# EAGLE board cs8416 (EAGLE 4.15)
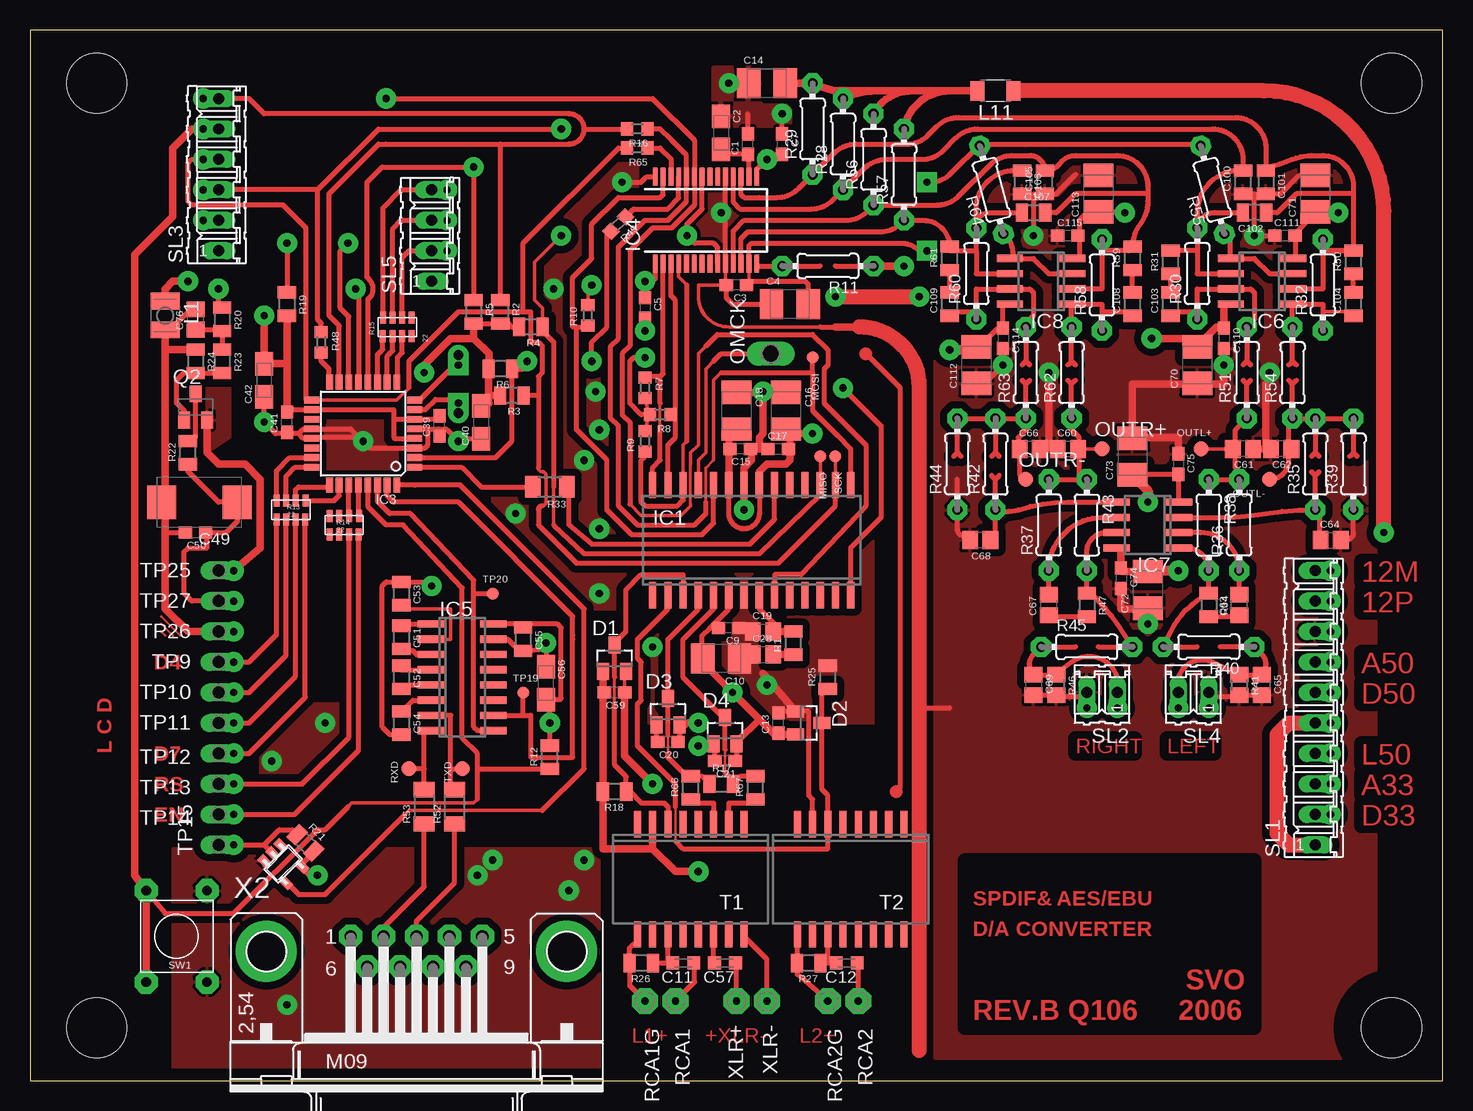
[diagram p2: board, top side]
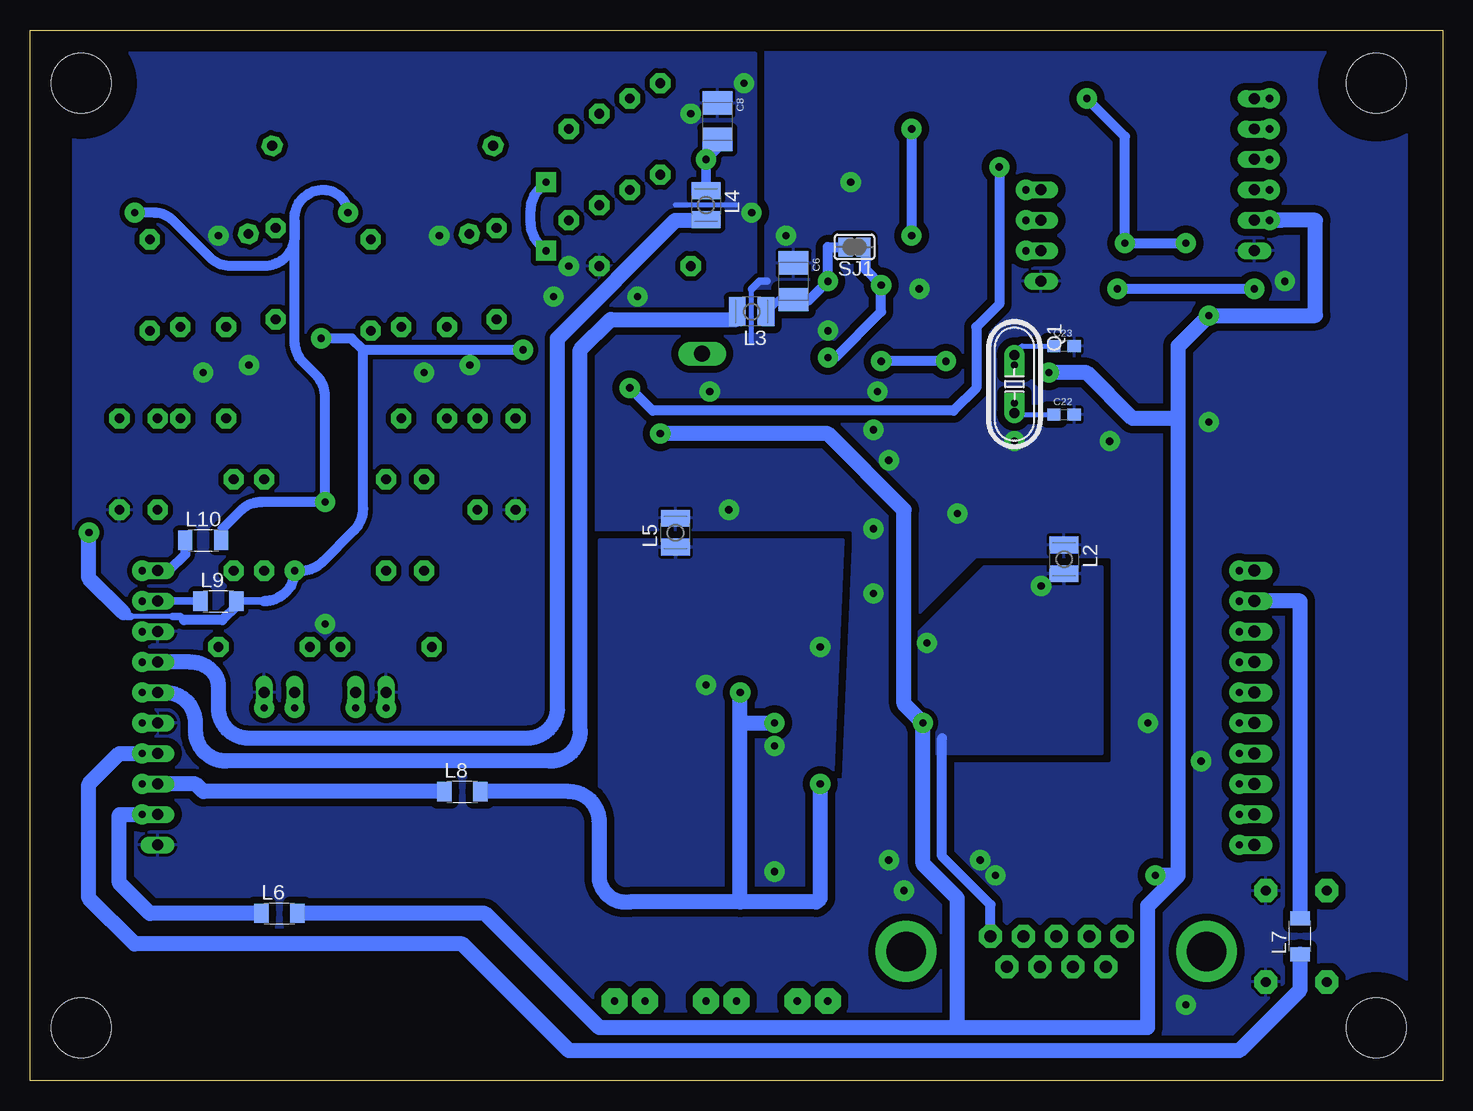
[diagram p3: board, bottom side, seen from below]

Size 117.78 x 87.62 mm. Coordinates in mm from the lower left corner, seen from the top.
Outline: 0,0 117.78,0 117.78,87.62 0,87.62 0,0
Copper layers (1*16): Top 0.035mm / dielectric 1.5mm / Bottom 0.035mm
Design rules "default": minimum track width 10mil, minimum drill 0.6mm, track to track 8mil, track to pad 8mil, pad to pad 8mil, via to via 8mil, smd to smd 0mil, copper to edge 40mil, drill to drill 8mil, minimum pad ring 10mil, minimum via ring 8mil, stop-mask expansion 4mil, vias tented up to drill 0mil, thermal gap 10mil
Net classes: 1 supply: width 0.406 mm, drill 0.5 mm, clearance 0.305 mm
Holes 5 mm at 5.55,83.18 5.55,4.44 113.5,4.44 113.5,83.18
tRestrict: area 109.5,0.4 to 117.5,8.5; area 109.5,79.2 to 117.5,87.2; area 1.5,79.2 to 9.6,87.2; area 1.7,0.6 to 9.4,8.2; area 80.5,4.4 to 99.5,18.4; area 77.9,4.4 to 80.5,18.4; area 99.5,4.4 to 102.1,18.4
bRestrict: area 1.5,79.2 to 9.6,87.2; area 1.7,0.6 to 9.4,8.3; area 109.5,0.4 to 117.5,8.5; area 109.5,79.2 to 117.5,87.2

## Footprints (pad centres in the part's own frame; a part is rotated, then mirrored left to right if it is on the bottom)
C0603 = smd 1.1 x 1: 1 -0.85,0; 2 0.85,0
A/3216-18R = smd 1.95 x 1.5: + 1.375,0; - -1.375,0
B/3528-21R = smd 1.95 x 2.5: + 1.525,0; - -1.525,0
C0603K = smd 1.05 x 1.08: 1 -0.875,0; 2 0.875,0
C0805 = smd 1.3 x 1.5: 1 -0.85,0; 2 0.85,0
SMC_E = smd 2.4 x 2.8: + -3.15,0; - 3.15,0
C0805S = smd 1.016 x 1.524: 1 -0.977,0; 2 0.977,0
SOT23 = smd 1 x 1.4: 1 -0.95,-1.1; 2 0.95,-1.1; 3 0,1.1
SO28W = smd 0.6 x 2.2: 1 -8.255,-4.6; 2 -6.985,-4.6; 3 -5.715,-4.6; 4 -4.445,-4.6; 5 -3.175,-4.6; 6 -1.905,-4.6; 7 -0.635,-4.6; 8 0.635,-4.6; 9 1.905,-4.6; 10 3.175,-4.6; 11 4.445,-4.6; 12 5.715,-4.6; 13 6.985,-4.6; 14 8.255,-4.6; 15 8.255,4.6; 16 6.985,4.6; 17 5.715,4.6; 18 4.445,4.6; 19 3.175,4.6; 20 1.905,4.6; 21 0.635,4.6; 22 -0.635,4.6; 23 -1.905,4.6; 24 -3.175,4.6; 25 -4.445,4.6; 26 -5.715,4.6; 27 -6.985,4.6; 28 -8.255,4.6
SOT23-5 = smd 0.69 x 0.99: 1 -0.95,-1.29; 2 0,-1.29; 3 0.95,-1.29; 4 0.95,1.3; 5 -0.95,1.3
TQFP32-08 = smd 1.27 x 0.559: 1 -4.293,2.8; 2 -4.293,2; 3 -4.293,1.2; 4 -4.293,0.4; 5 -4.293,-0.4; 6 -4.293,-1.2; 7 -4.293,-2; 8 -4.293,-2.8; 17 4.293,-2.8; 18 4.293,-2; 19 4.293,-1.2; 20 4.293,-0.4; 21 4.293,0.4; 22 4.293,1.2; 23 4.293,2; 24 4.293,2.8 | smd 0.559 x 1.27: 9 -2.8,-4.293; 10 -2,-4.293; 11 -1.2,-4.293; 12 -0.4,-4.293; 13 0.4,-4.293; 14 1.2,-4.293; 15 2,-4.293; 16 2.8,-4.293; 25 2.8,4.293; 26 2,4.293; 27 1.2,4.293; 28 0.4,4.293; 29 -0.4,4.293; 30 -1.2,4.293; 31 -2,4.293; 32 -2.8,4.293
SSOP28 = smd 0.4 x 1.5: 1 -4.225,-3.625; 2 -3.575,-3.625; 3 -2.925,-3.625; 4 -2.275,-3.625; 5 -1.625,-3.625; 6 -0.975,-3.625; 7 -0.325,-3.625; 8 0.325,-3.625; 9 0.975,-3.625; 10 1.625,-3.625; 11 2.275,-3.625; 12 2.925,-3.625; 13 3.575,-3.625; 14 4.225,-3.625; 15 4.225,3.625; 16 3.575,3.625; 17 2.925,3.625; 18 2.275,3.625; 19 1.625,3.625; 20 0.975,3.625; 21 0.325,3.625; 22 -0.325,3.625; 23 -0.975,3.625; 24 -1.625,3.625; 25 -2.275,3.625; 26 -2.925,3.625; 27 -3.575,3.625; 28 -4.225,3.625
SO16 = smd 0.6 x 2.2: 1 -4.445,-2.6; 2 -3.175,-2.6; 3 -1.905,-2.6; 4 -0.635,-2.6; 5 0.635,-2.6; 6 1.905,-2.6; 7 3.175,-2.6; 8 4.445,-2.6; 9 4.445,2.6; 10 3.175,2.6; 11 1.905,2.6; 12 0.635,2.6; 13 -0.635,2.6; 14 -1.905,2.6; 15 -3.175,2.6; 16 -4.445,2.6
SO08 = smd 0.6 x 2.2: 1 -1.905,-2.6; 2 -0.635,-2.6; 3 0.635,-2.6; 4 1.905,-2.6; 5 1.905,2.6; 6 0.635,2.6; 7 -0.635,2.6; 8 -1.905,2.6
L2825P = smd 1.4 x 2.4: 1 -1.2,0; 2 1.2,0
L3216C = smd 1.2 x 1.6: 1 -1.5,0; 2 1.5,0
TP10R = smd 1 x 1: TP 0,0
P1-13Y = drill 1.321 pad 1.905 long: 1 0,0
B1,27 = smd 1.27 x 1.27: PP 0,0
HC49/S = drill 0.813 pad 1.676 round: 1 -2.413,0; 2 2.413,0
SOT23-BEC = smd 1 x 1.4: B -0.95,-1.1; C 0,1.1; E 0.95,-1.1
R0805-SVO = smd 1.016 x 1.524: 1 -0.977,0; 2 0.977,0
R0603 = smd 1 x 1.1: 1 -0.85,0; 2 0.85,0
0204/7 = drill 0.813 pad 1.676 octagon: 1 -3.81,0; 2 3.81,0
RESSMD-YC16 = smd 0.5 x 1: R1$1 -1.23,-0.77; R1$2 -1.2,0.8; R2$1 -0.4,-0.77; R2$2 -0.4,0.8; R3$1 0.4,-0.77; R3$2 0.4,0.8; R4$1 1.2,-0.77; R4$2 1.2,0.8
R1206-GAP = smd 1.27 x 1.778: 1 -1.422,0; 2 1.422,0
R0805 = smd 1.3 x 1.5: 1 -0.85,0; 2 0.85,0
P1-13 = drill 0.61 pad 2.159 octagon: 1 0,0
SJ = smd 1.168 x 1.6: 1 -0.762,0; 2 0.762,0
10P = drill 0.914 long: 1 -11.43,0; 2 -8.89,0; 3 -6.35,0; 4 -3.81,0; 5 -1.27,0; 6 1.27,0; 7 3.81,0; 8 6.35,0; 9 8.89,0; 10 11.43,0
02P = drill 0.914 long: 1 -1.27,0; 2 1.27,0
06P = drill 0.914 long: 1 -6.35,0; 2 -3.81,0; 3 -1.27,0; 4 1.27,0; 5 3.81,0; 6 6.35,0
04P = drill 0.914 long: 1 -3.81,0; 2 -1.27,0; 3 1.27,0; 4 3.81,0
6X6_BUTTON_THRU = drill 0.813 pad 1.93 octagon: 1 -2.54,3.81; 2 -2.54,-3.81; 3 2.54,-3.81; 4 2.54,3.81
SO16WW = smd 0.6 x 2.2: 1 -4.445,-4.6; 2 -3.175,-4.6; 3 -1.905,-4.6; 4 -0.635,-4.6; 5 0.635,-4.6; 6 1.905,-4.6; 7 3.175,-4.6; 8 4.445,-4.6; 9 4.445,4.6; 10 3.175,4.6; 11 1.905,4.6; 12 0.635,4.6; 13 -0.635,4.6; 14 -1.905,4.6; 15 -3.175,4.6; 16 -4.445,4.6
P1-13Y-SVO = drill 1 long: 1 0,0
M09HP = drill 1.016 pad 1.93 octagon: 1 -5.486,1.27; 2 -2.743,1.27; 3 0,1.27; 4 2.743,1.27; 5 5.486,1.27; 6 -4.115,-1.27; 7 -1.372,-1.27; 8 1.372,-1.27; 9 4.115,-1.27 | drill 3.302 pad 5.08 round: G1 -12.522,0; G2 12.522,0

## Placement (x,y rotation side)
C1  100nF  [C0603]  59.84,78.1 90 top
C2  10uF  [A/3216-18R]  57.62,79.05 270 top
C3  100nF  [C0603]  58.89,66.35 180 top
C4  47uF  [B/3528-21R]  63.34,64.77 0 top
C5  100nF  [C0603]  51.27,64.45 270 top
C6  47uF  [B/3528-21R]  54.13,66.67 270 bottom
C7  100nF  [C0603]  62.7,78.1 270 top
C8  47uF  [B/3528-21R]  60.48,80 270 bottom
C9  100nF  [C0603]  58.26,37.78 180 top
C10  47uF  [B/3528-21R]  57.62,35.24 180 top
C11  100nF  [C0603K]  54.45,9.84 180 top
C12  100nF  [C0603K]  68.1,9.84 180 top
C13  100nF  [C0603]  62.38,29.84 90 top
C14  4.7uF  [B/3528-21R]  61.43,83.18 0 top
C15  100nF  [C0603]  59.21,52.7 180 top
C16  47uF  [B/3528-21R]  63.02,55.88 270 top
C17  100nF  [C0603]  62.38,52.7 0 top
C18  47uF  [B/3528-21R]  58.89,55.88 270 top
C19  10NF:C0G  [C0805]  61.11,37.46 0 top
C20  100nF  [C0603]  53.17,28.25 180 top
C21  100nF  [C0603]  57.94,26.66 180 top
C22  22pF  [C0603]  31.59,55.56 0 bottom
C23  22pF  [C0603]  31.59,61.27 0 bottom
C28  220nF:X7R  [C0805]  61.11,35.55 0 top
C39  100nF  [C0603]  34.12,54.61 90 top
C40  4.7uF  [A/3216-18R]  37.62,54.92 90 top
C41  100nF  [C0603]  21.42,54.92 90 top
C42  4.7uF  [A/3216-18R]  19.52,58.41 90 top
C49  220uF  [SMC_E]  14.12,48.26 180 top
C50  100nF  [C0603]  13.8,45.72 180 top
C51  100nF  [C0805S]  30.95,36.98 270 top
C52  100nF  [C0805S]  30.95,33.65 270 top
C53  100nF  [C0805S]  30.95,40.64 270 top
C54  100nF  [C0805S]  30.95,29.84 270 top
C55  100nF  [C0805S]  41.11,36.83 270 top
C56  4.7uF  [A/3216-18R]  43.01,33.17 270 top
C57  100nF  [C0603K]  57.94,9.84 180 top
C59  100nF  [C0603]  48.73,32.38 180 top
C60  5.6nF NP0  [C0805]  86.51,52.7 0 top
C61  5.6nF NP0  [C0805]  101.12,52.7 180 top
C62  5.6nF NP0  [C0805]  104.29,52.7 180 top
C63  2.7nF NP0  [C0805]  100.8,39.68 90 top
C64  2.7nF NP0  [C0805]  108.42,45.08 0 top
C65  3.9nF  [C0805]  102.7,33.02 270 top
C66  5.6nF NP0  [C0805]  83.34,52.7 0 top
C67  2.7nF NP0  [C0805]  84.92,39.68 90 top
C68  2.7nF NP0  [C0805]  79.21,45.08 180 top
C69  3.9nF  [C0805]  83.66,33.02 270 top
C70  4.7uF  [B/3528-21R]  97.31,59.69 90 top
C71  4.7uF  [B/3528-21R]  107.15,73.97 90 top
C72  4.7uF  [B/3528-21R]  93.18,40.95 90 top
C73  4.7uF  [B/3528-21R]  91.91,52.07 90 top
C74  100nF  [C0603]  90.96,41.91 270 top
C75  100nF  [C0603]  95.72,51.43 270 top
C76  100nF  [C0805]  13.8,63.5 90 top
C100  NC  [C0805S]  101.12,74.92 90 top
C101  NC  [C0805S]  103.02,74.92 270 top
C102  100pF  [C0805S]  102.07,72.39 180 top
C103  100pF  [C0805S]  95.08,64.77 90 top
C104  100pF  [C0805S]  110.33,64.77 90 top
C105  NC  [C0805S]  84.61,74.92 90 top
C106  NC  [C0805S]  82.7,74.92 270 top
C107  100pF  [C0805S]  83.66,72.39 0 top
C108  100pF  [C0805S]  91.91,64.77 90 top
C109  100pF  [C0805S]  76.67,64.77 90 top
C110  100nF  [C0603]  99.53,61.91 270 top
C111  100nF  [C0603]  104.61,70.48 0 top
C112  4.7uF  [B/3528-21R]  78.89,59.69 90 top
C113  4.7uF  [B/3528-21R]  89.05,73.97 90 top
C114  100nF  [C0603]  81.11,61.91 270 top
C115  100nF  [C0603]  86.51,70.48 0 top
D1  BAT54S  [SOT23]  48.73,35.24 0 top
D2  BAT54S  [SOT23]  64.92,29.84 270 top
D3  BAT54S  [SOT23]  53.17,30.79 0 top
D4  BAT54S  [SOT23]  57.94,29.2 0 top
IC1  CS8416-CSZ  [SO28W]  60.16,45.08 0 top
IC2  74AHC1G14DBV  [SOT23-5]  21.11,18.09 225 top
IC3  MEGA8-AI  [TQFP32-08]  27.77,53.97 180 top
IC4  AD1955  [SSOP28]  56.35,71.75 0 top
IC5  ADM3202ARN  [SO16]  36.03,33.65 270 top
IC6  OP275S  [SO08]  102.7,66.67 90 top
IC7  OP275S  [SO08]  93.18,46.35 90 top
IC8  OP275S  [SO08]  84.29,66.67 90 top
L1  [L2825P]  11.26,63.81 270 top
L2  [L2825P]  31.59,43.49 270 bottom
L3  [L2825P]  57.62,64.13 180 bottom
L4  [L2825P]  61.43,73.02 270 bottom
L5  [L2825P]  63.97,45.72 90 bottom
L6  [L3216C]  96.99,13.96 0 bottom
L7  [L3216C]  11.9,12.06 90 bottom
L8  [L3216C]  81.75,24.12 0 bottom
L9  [L3216C]  102.07,40 0 bottom
L10  [L3216C]  103.34,45.08 0 bottom
L11  [L3216C]  80.48,82.55 180 top
MISO  TPTP10R  [TP10R]  65.88,52.07 270 top
MOSI  TPTP10R  [TP10R]  65.24,60.32 270 top
OMCK  TPSPAD1-13Y  [P1-13Y]  61.75,60.64 90 top
OUTL+  TPB1,27  [B1,27]  97.62,52.7 90 top
OUTL-  TPB1,27  [B1,27]  103.34,50.16 270 top
OUTR+  TPB1,27  [B1,27]  89.37,52.7 0 top
OUTR-  TPB1,27  [B1,27]  83.02,50.16 0 top
Q1  [HC49/S]  35.71,58.1 270 bottom
Q2  BC817-40SMD  [SOT23-BEC]  13.8,56.19 0 top
R1  1K  [R0805-SVO]  63.65,36.51 90 top
R2  4.7K  [R0805-SVO]  39.2,64.13 270 top
R3  4.7K  [R0805-SVO]  40.16,57.15 180 top
R4  4.7K  [R0805-SVO]  41.74,62.86 180 top
R5  4.7K  [R0805-SVO]  36.98,64.13 270 top
R6  4.7K  [R0805-SVO]  39.2,59.37 180 top
R7  4.7K  [R0603]  51.27,57.78 270 top
R8  4.7K  [R0603]  52.54,55.56 180 top
R9  4.7K  [R0603]  51.27,53.34 90 top
R10  4.7K  [R0603]  46.51,63.81 90 top
R11  2.49K  [0204/7]  66.51,67.94 180 top
R12  10K  [R0805-SVO]  43.33,26.98 90 top
R13  22  [RESSMD-YC16]  21.74,47.62 180 top
R14  22  [RESSMD-YC16]  26.19,46.35 180 top
R15  22  [RESSMD-YC16]  30.63,62.86 0 top
R16  22  [R0603]  50.63,79.37 180 top
R17  90.9  [R0805-SVO]  57.62,24.76 0 top
R18  75  [R0805-SVO]  48.73,24.12 180 top
R19  10K  [R0805-SVO]  21.42,64.77 270 top
R20  1K  [R0805-SVO]  16.03,63.5 270 top
R21  10K  [R0805-SVO]  22.96,19.86 315 top
R22  47  [R0805-SVO]  13.17,52.38 90 top
R23  1K  [R0805-SVO]  16.03,60 270 top
R24  10K  [R0805-SVO]  13.8,60 270 top
R25  75  [R0805-SVO]  66.51,33.65 90 top
R26  NC  [R0805-SVO]  50.95,9.84 180 top
R27  NC  [R0805-SVO]  64.92,9.84 180 top
R28  2.00K  [0204/7]  67.78,78.1 90 top
R29  2.00K  [0204/7]  65.24,79.37 90 top
R30  2.00K  [0204/7]  97.31,67.31 90 top
R31  100  [R0805-SVO]  95.08,68.26 90 top
R32  2.00K  [0204/7]  107.78,66.35 90 top
R33  000  [R1206-GAP]  43.33,49.52 180 top
R34  100  [R0805-SVO]  98.26,39.68 270 top
R35  324  [0204/7]  107.15,51.43 90 top
R36  324  [0204/7]  100.8,46.35 90 top
R37  324  [0204/7]  84.92,46.35 90 top
R38  226  [0204/7]  98.26,46.35 270 top
R39  226  [0204/7]  110.33,51.43 90 top
R40  332  [0204/7]  98.26,36.19 180 top
R41  OPEN  [R0805]  100.8,33.02 270 top
R42  324  [0204/7]  80.48,51.43 90 top
R43  226  [0204/7]  88.1,46.35 270 top
R44  226  [0204/7]  77.3,51.43 90 top
R45  332  [0204/7]  88.1,36.19 0 top
R46  OPEN  [R0805]  85.56,33.02 270 top
R47  100  [R0805-SVO]  88.1,39.68 270 top
R48  22  [R0603]  24.28,61.59 270 top
R49  22  [R0603]  49.05,71.43 225 top
R50  100  [R0805-SVO]  110.33,68.26 90 top
R51  681  [0204/7]  101.44,59.05 90 top
R52  000  [R1206-GAP]  35.39,22.85 90 top
R53  000  [R1206-GAP]  32.86,22.85 90 top
R54  681  [0204/7]  105.25,59.05 90 top
R55  402  [0204/7]  98.58,74.29 105 top
R56  2.00K  [0204/7]  70.32,76.83 90 top
R57  2.00K  [0204/7]  72.86,75.56 90 top
R58  2.00K  [0204/7]  89.37,66.35 90 top
R59  100  [R0805-SVO]  91.91,68.58 90 top
R60  2.00K  [0204/7]  78.89,67.31 90 top
R61  100  [R0805-SVO]  76.67,68.58 90 top
R62  681  [0204/7]  86.83,59.05 90 top
R63  681  [0204/7]  83.02,59.05 90 top
R64  402  [0204/7]  80.16,74.29 105 top
R65  22  [R0603]  50.63,77.78 180 top
R66  10  [R0805-SVO]  55.08,24.44 90 top
R67  10  [R0805-SVO]  60.48,24.44 90 top
RCA1  TPSPAD1-13  [P1-13]  53.81,6.66 0 top
RCA1G  TPSPAD1-13  [P1-13]  51.27,6.66 0 top
RCA2  TPSPAD1-13  [P1-13]  69.05,6.66 0 top
RCA2G  TPSPAD1-13  [P1-13]  66.51,6.66 0 top
RXD  TPB1,27  [B1,27]  31.59,26.03 0 top
SCK  TPTP10R  [TP10R]  67.14,52.07 270 top
SJ1  [SJ]  49.05,69.53 180 bottom
SL1  [10P]  107.15,31.11 90 top
SL2  [02P]  89.37,32.38 180 top
SL3  [06P]  15.71,75.56 90 top
SL4  [02P]  96.99,32.38 180 top
SL5  [04P]  33.49,70.48 90 top
SW1  BUTTON_6X6_THRU  [6X6_BUTTON_THRU]  12.22,12.06 0 top
T1  TG26-1205N1  [SO16WW]  55.08,16.82 180 top
T2  TG26-1205N1  [SO16WW]  68.41,16.82 180 top
TP9  TPPAD1-10Y  [P1-13Y-SVO]  15.71,34.92 90 top
TP10  TPPAD1-10Y  [P1-13Y-SVO]  15.71,32.38 90 top
TP11  TPPAD1-10Y  [P1-13Y-SVO]  15.71,29.84 90 top
TP12  TPPAD1-10Y  [P1-13Y-SVO]  15.71,27.3 90 top
TP13  TPPAD1-10Y  [P1-13Y-SVO]  15.71,24.76 90 top
TP14  TPPAD1-10Y  [P1-13Y-SVO]  15.71,22.22 270 top
TP15  TPPAD1-10Y  [P1-13Y-SVO]  15.71,19.68 90 top
TP19  TPTP10R  [TP10R]  41.11,32.38 0 top
TP20  TPTP10R  [TP10R]  38.57,40.64 0 top
TP25  TPPAD1-10Y  [P1-13Y-SVO]  15.71,42.54 90 top
TP26  TPPAD1-10Y  [P1-13Y-SVO]  15.71,37.46 90 top
TP27  TPPAD1-10Y  [P1-13Y-SVO]  15.71,40 90 top
TXD  TPB1,27  [B1,27]  36.03,26.03 0 top
X2  [M09HP]  32.22,10.79 0 top
XLR+  TPSPAD1-13  [P1-13]  58.89,6.66 0 top
XLR-  TPSPAD1-13  [P1-13]  61.43,6.66 0 top

## Tracks (layer width: path | path; a pad name or v marks a point on that pad's centre or on a via)
+5VLCD
  Top 0.406: TP27.1 13.49,40 12.85,40.64 12.85,44.13 13.17,44.45 14.76,44.45 14.76,45.72 C50.1 16.34,45.72 17.3,46.67 17.3,48.26 C49.+ 15.71,48.26 13.17,50.8 R22.1
  Bottom 1.27: TP27.1 11.9,40 L7.2
+12V  (via drill 0.6 pad 1.68)
  Top 0.305: 97.31,61.91 C70.+
  Top 0.406: 100.17,64.77 IC6.8 99.53,64.77 | IC8.8 81.11,64.77 C114.1 80.69,62.76 79.15,61.21 C112.+
  Top 0.61: IC7.8 90.96,44.45 C74.1 90.96,42.54 91.02,42.48 C72.+ | v93.5,61.91 97.31,61.91 97.94,61.91 98.89,62.86 99.21,62.86 99.31,62.76 C110.1 99.53,64.77
  Top 0.813: C72.+ 93.18,42.54 v95.72,42.54 | C112.+ 78.83,61.21 78.58,60.95 v76.67,60.95
  Top 1.27: L11.1 102.86,82.55 arc-90 112.86,72.55 v112.86,45.72
  Bottom 0.406: 105.88,38.73 109.37,38.73
  Bottom 0.61: 98.26,40 L9.2 100.57,39.59 | 104.93,38.41 105.25,38.73 105.88,38.73 | 109.37,38.73 109.69,38.73 110.01,39.05
  Bottom 0.813: 98.26,40 arc-90 v95.72,42.54 95.19,42.54 arc-45 93.39,43.28 90.75,45.92 arc-45 90,47.72 90,60.95 | 100.57,39.59 101.75,38.41 104.93,38.41 | 90,60.95 v76.67,60.95 | v93.5,61.91 90.96,61.91 90,60.95
  Bottom 1.27: 110.01,39.05 112.86,41.91 v112.86,45.72
-12V  (via drill 0.6 pad 1.68)
  Top 0.406: IC6.4 105.56,68.58 105.46,68.68 C111.2 105.46,70.7 107.15,72.39 C71.- | IC7.4 95.72,48.26 C75.2 92.01,50.58 arc90 91.91,50.48 | 87.47,71.75 88.16,72.45 C113.- 91.21,72.45 v91.28,72.39 | C115.2 87.47,70.48 87.47,71.75 | 87.47,71.75 87.47,68.58 IC8.4 86.83,68.58
  Top 0.813: C73.- 91.91,50.48 93.18,49.21 v93.18,48.26 | C71.- 108.99,72.45 v109.05,72.39
  Bottom 0.813: 95.72,71.75 95.72,61.69 arc-45 94.98,59.89 93.92,58.84 arc45 93.18,57.05 v93.18,48.26 98.48,48.26 arc-45 100.27,47.51 101.75,46.03 101.75,45.08 L10.2 | 95.72,71.75 95.72,70.48 arc90 98.26,67.94 101.02,67.94 arc45 102.81,68.68 105.88,71.75 arc-45 107.41,72.39 v109.05,72.39 | 95.72,71.75 arc90 93.5,74.29 arc90 v91.28,72.39
AGND  (via drill 0.6 pad 1.68)
  Top 0.305: 57.98,72.03 v57.62,72.39 57.98,72.74 | IC4.10 57.98,66.07 57.94,66.03 C3.2 55.71,66.35 55.71,65.4 arc90 58.26,62.86 65.88,62.86 | 101.12,73.97 C100.1 | v102.07,70.48 C111.1 | 102.07,73.95 102.07,73.97 | C101.2 103.02,73.97 | C70.- 98,58.8 | C106.2 82.7,73.97 82.73,73.95 83.66,73.95 | 83.66,73.95 C105.1 | 83.66,73.95 83.66,73.97
  Top 0.406: IC4.10 57.98,72.03 | C7.1 v62.7,80.64 | C1.2 59.84,80.64 | C111.1 v102.07,70.48 102.07,73.95 | v99.53,59.69 C110.2 | 102.07,73.95 101.14,73.95 101.12,73.97 | 102.07,73.95 C101.2 | C71.+ 105.82,75.5 104.29,73.97 103.02,73.97 | 83.66,73.95 v83.66,70.48 | C105.1 85.53,73.95 87.15,75.56 | 79.53,58.1 v81.11,59.69 | C66.2 84.92,52.7 C60.1 | 103.02,52.7 C62.2 | C68.2 78.26,45.08 77.94,45.4 arc-90 77.3,46.03 R44.1 77.3,50.16 | C64.2 109.69,45.08 arc90 110.33,45.72 R39.1 | C69.2 85.46,32.16 85.56,32.06 | 100.8,32.06 R41.2 | C65.2 100.9,32.16 100.8,32.06 | 85.56,32.06 R46.2 | 85.56,32.06 87.78,32.06 SL2.2 | 100.8,32.06 98.58,32.06 SL4.1 | 74.13,31.11 76.67,31.11 | 65.88,62.86 67.14,62.86 | 67.14,67.94 R11.1 | 57.98,72.74 IC4.19 | C2.- 57.62,80.64 | C14.- v58.26,83.18 | C3.2 58.04,65.3 58.57,64.77 C4.-
  Top 0.61: R11.1 v72.86,67.94 | C61.1 103.02,52.7 103.02,58.1 | 96.67,58.1 C70.- | 96.67,58.1 99.53,58.1 v99.53,59.69 | 96.67,58.1 91.91,58.1 91.91,53.65 | 84.92,52.7 84.92,58.1 | C75.1 95.72,53.65 91.91,53.65 | C73.+ 91.91,53.65 | C74.2 90.96,39.37 92.86,39.37 92.92,39.43 C72.- v93.18,38.09 | 67.14,62.86 69.05,62.86
  Top 1.27: 74.13,2.54 74.13,31.11 74.13,57.86 arc90 69.13,62.86 | v67.14,65.4 v74.13,65.4
  Bottom 0.406: 58.89,73.02 63.97,73.02
  other vias: 84.92,59.05 103.34,59.05
  pour Bottom (isolate 0.406, rank 2): 57.3,85.72 57.3,63.5 72.86,63.5 72.86,27.3 114.14,27.3 114.14,85.72
  pour Top (isolate 0.61, rank 2): 75.4,83.18 75.4,1.9 112.23,1.9 112.23,83.18
  pour Top (isolate 0.305, rank 2): 55.08,73.97 59.52,73.97 59.52,69.53 55.08,69.53
  pour Top (isolate 0.305, rank 2): 56.98,84.45 56.98,79.69 63.34,79.69 63.34,80.96 63.02,81.28 61.11,81.28 60.8,81.59 60.8,84.45
AVDD  (via drill 0.6 pad 1.68)
  Top 0.305: 60.58,75.98 IC4.15
  Top 0.406: 60.58,75.98 v61.43,76.83 61.85,77.25 C7.2
  Bottom 0.305: 60.48,77.78 C8.+
  Bottom 0.8: L4.1 v61.43,76.83 60.48,77.78
AVDDDAC
  Bottom 1.27: L4.2 61.43,71.75 63.97,71.75 73.81,61.91 73.81,31.11 arc90 76.35,28.57 99.53,28.57 arc90 102.07,31.11 102.07,32.91 arc-45 102.6,34.18 arc-45 104.39,34.92 SL1.7
B1IN  (via drill 0.6 pad 1.68)
  Top 0.406: IC2.2 | TP15.1 v16.98,19.68 19.52,19.68 | 19.52,19.68 IC2.2 | R21.1 21.87,20.95 20.79,20.95 19.52,19.68
BATON1
  Top 0.305: 42.7,22.54 31.59,22.54 31.27,22.22
  Top 0.406: IC3.32 32.07,49.68 32.06,49.68 | 21.43,16.5 IC2.4 21.42,16.5 21.42,16.51 22.38,15.55 24.6,15.55 31.27,22.22 | 42.7,22.54 46.19,26.03 46.19,39.37 35.87,49.68 32.06,49.68 | 32.06,49.68
BCLK
  Top 0.305: 53.81,55.56 R8.1
  Top 0.406: IC1.27 53.17,53.02 53.81,53.65 53.81,55.56 53.81,65.08 53.42,65.47 IC4.3
COM_GND  (via drill 0.6 pad 1.68)
  Top 0.305: 43.02,34.92 | C56.- 43.02,34.92 | 43.02,34.92 42.66,35.27 | v43.02,36.51
  Top 0.406: C56.- v43.02,36.51 42.48,35.98 C55.2 40.69,35.98 39.84,36.83 IC5.15 | C54.2 30.95,28.89 30,28.89 29.36,29.52 29.36,41.27 29.7,41.61 C53.1 33.15,41.61 v33.49,41.27
  Bottom 0.813: X2.5 37.71,14.69 41.74,18.73 41.74,28.57
  pour Bottom (isolate 0.406): 28.41,27.3 28.41,42.86 38.25,42.86 43.65,37.46 43.65,27.3
COM_RXD
  Top 0.406: R53.2 32.86,26.03 | 32.86,26.03 RXD.PP | 32.86,26.03 32.86,29.2 IC5.8 33.49,29.2
COM_TXD
  Top 0.406: IC5.7 35.08,30.48 35.08,26.03 | R52.2 35.24,24.28 35.08,24.44 35.08,26.03 | 35.08,26.03 TXD.PP
DVDD  (via drill 0.6 pad 1.68)
  Top 0.406: IC4.1 52.12,66.89 v51.27,66.67 C5.1
  Bottom 0.61: L3.1 56.35,64.13 55.4,65.08 54.13,65.08 | 52.86,65.08 54.13,65.08 | 54.13,65.08 C6.+
  Bottom 0.813: SJ1.2 51.27,69.53 v51.27,66.67 52.86,65.08
DVDD_33  (via drill 0.6 pad 1.68)
  Top 0.254: 63.34,53.97 C16.+
  Top 0.305: 38.25,59.37 R6.2 | R2.2 39.2,63.18 | R5.2 37.28,63.15 37.3,63.18 37.33,63.15 | IC1.23 58.26,49.84 | 43.33,31.43 43.02,31.74
  Top 0.406: 30.31,55.24 30.38,55.17 IC3.6 34.05,55.17 34.12,55.24 C39.2 | 30.31,55.24 30.31,55.97 IC3.18 21.65,55.97 21.42,56.19 C41.2 | IC3.4 30.4,53.57 30.31,53.65 30.31,55.24 | R21.2 23.65,19.05 22.7,18.1 IC2.5 22.7,17.77 23.33,17.14 v23.96,17.14 | 43.33,27.94 R12.2 v43.33,29.84 43.33,31.43 | 39.2,63.18 39.84,63.18 40.16,62.86 R4.2 | 37.33,63.15 R2.2 | R3.2 39.2,57.15 | IC1.23 58.26,47.3 arc90 59.52,46.03 arc90 60.8,47.3 IC1.21 | 44.13,37.94 44.28,37.78 44.28,31.9 44.18,31.8 C56.+ 43.02,31.74 | 43.02,31.74 | 41.11,38.09 IC5.16 | 44.13,37.94 | 44.13,37.94 43.97,38.09 41.11,38.09 | 41.11,38.09 C55.1 | 21.32,59.79 21.42,59.69
  Top 0.61: v19.52,63.81 C42.+ 21.32,59.79 | 63.34,52.7 63.34,51.75 63.02,51.43 61.43,51.43 60.8,50.8 IC1.21 | C18.+ 58.26,53.65 58.26,52.7 | 63.34,52.7 63.34,53.97 v65.24,53.97 | 38.25,59.37 38.25,60.64 36.98,61.91 | 36.98,61.91 R5.2 | 63.34,52.7 C17.2 | 58.57,52.7 C15.2 58.26,52.7 | 58.26,49.84 58.26,52.7 | 21.42,56.19 21.42,59.69 R19.2 | 36.98,61.91 35.08,61.91 32.86,59.69 v32.86,59.05 | C40.+ 38.04,56.3 38.25,56.51 38.23,56.53 38.23,57.15 | R6.2 38.23,57.15 | 38.23,57.15 R3.2
  Bottom 1.27: v32.86,59.05 29.68,59.05 25.87,55.24 22.06,55.24 | 22.06,55.24 22.06,61.27 v19.52,63.81 10.63,63.81 10.63,71.75 v14.44,71.75 | 22.06,17.14 22.06,55.24 | v14.44,71.75 SL3.2 v14.44,71.75 | v14.44,71.75 13.49,71.75 | 22.06,17.14 v23.96,17.14 | 40.47,4.44 24.6,4.44 24.6,14.6 22.06,17.14 | 40.47,4.44 70.32,4.44 79.84,13.96 L6.2 | 40.47,4.44 40.47,15.23 43.33,18.09 v43.33,29.84 44.92,31.43 44.92,47.62 51.27,53.97 v65.24,53.97
DVDDDAC
  Bottom 1.27: SL1.6 106.52,32.38 arc90 103.97,29.84 103.97,29.2 arc-90 101.44,26.66 74.45,26.66 arc-90 71.91,29.2 71.91,60.95 69.37,63.5 58.89,63.5 58.89,64.13 L3.2
GND  (via drill 0.6 pad 1.68)
  Top 0.254: 27.89,53.22 v27.77,53.34 27.14,53.97
  Top 0.305: 56.03,75.24 56.02,75.25 IC4.22
  Top 0.406: v27.77,53.34 26.74,54.37 IC3.20 22.78,54.37 22.38,53.97 | v27.77,53.34 28.34,52.77 IC3.3 32.92,52.77 33.17,53.02 33.17,54.37 | C42.- v19.52,54.92 20.47,53.97 21.42,53.97 | C5.2 v51.27,62.54 | IC4.28 51.4,75.38 50.95,74.92 v49.37,74.92 | 23.33,53.65 27.46,53.65 v27.77,53.34 | 56.03,75.24 56.03,72.7 54.76,71.43 v54.76,70.48 55.4,69.84 56.98,69.84 57.33,69.5 IC4.9 | 34.12,54.29 C39.1 | IC3.21 22.78,53.57 22.38,53.97 | 21.42,53.97 C41.1 | 22.38,53.97 21.42,53.97 | 33.17,54.37 34.04,54.37 34.12,54.29 | 33.17,54.37 33.09,54.37 | 33.17,54.37 IC3.5 | C40.- 35.92,53.55 v35.71,53.34 34.76,54.29 | 33.17,54.37 34.68,54.37 34.76,54.29 | 34.76,54.29 34.12,54.29
  Top 0.61: 60.16,52.7 60.8,52.7 | 60.8,52.7 C17.1 | v61.11,57.46 61.11,53.97 60.8,53.65 60.8,52.7 | IC1.22 59.52,51.11 60.16,51.75 60.16,52.7 | 60.16,52.7 C15.1 | C18.- 60.86,57.4 v61.11,57.46 | C16.- 61.37,57.4 v61.11,57.46 | v13.17,66.67 11.9,66.67 11.26,66.03 L1.1 | v59.52,47.62 59.52,49.52
  Top 1.27: SL1.1 104.93,19.68 103.97,20.63 103.97,28.89 104.93,29.84 SL1.5
  Bottom 0.406: 57.62,61.59 57.62,66.03
  Bottom 0.61: 56.35,66.67 56.98,66.67 57.62,66.03
  other vias: 24.6,29.84 38.57,18.41 21.42,6.34 46.19,18.41 40.47,47.3 47.46,46.03 47.14,57.46 47.46,54.29 46.19,51.75 43.65,66.03 47.46,40.64 20.16,26.66 37.3,17.14 44.92,15.87
  pour Bottom (isolate 0.61, rank 3): 75.72,85.72 75.72,34.92 117.31,34.92 117.31,0.63 3.01,0.63 3.01,85.72
  pour Top (isolate 0.61): 26.5,54.29 26.5,52.7 29.04,52.7 29.04,54.29
  pour Top (isolate 0.61): 24.6,55.88 24.6,50.8 30.63,50.8 30.63,55.88
  pour Top (isolate 0.61, rank 2): 11.9,19.36 11.9,0.63 47.46,0.63 47.46,19.36
  pour Top (isolate 0.61, rank 2, no thermals): 38.57,80.64 38.57,39.37 50.63,39.37 50.63,80.64
  pour Top (isolate 0.61, rank 2): 19.2,27.3 19.2,24.12 28.41,24.12 28.41,31.43 19.2,31.43
IOUTL+
  Top 0.305: C100.2 101.12,75.88 100.48,75.88
  Top 0.406: IC4.18 58.62,73.28 59.21,72.7 65.14,72.7 arc45 66.94,73.45 R28.1 69.58,76.09 arc-45 71.37,76.83 74.35,76.83 arc45 76.14,77.57 77.2,78.63 arc-45 78.99,79.37 98.58,79.37 arc-90 101.12,76.83 C100.2 | IC6.6 97.31,67.31 97.31,69.21 | R30.2 97.31,69.21 | R31.2 95.08,69.21 97.31,69.21 | C102.2 101.12,72.39 | C102.2 100.8,72.39 | C102.2 98.89,72.39 arc90 R30.2 | 100.48,75.88 arc90 97.31,72.07 R30.2
IOUTL-
  Top 0.406: IC4.17 59.27,73.91 59.52,73.66 60.8,73.66 62.28,73.66 arc45 64.08,74.4 R29.1 67.04,77.36 arc-45 68.83,78.1 73.08,78.1 arc45 74.87,78.84 75.61,79.58 arc-45 77.41,80.32 100.48,80.32 arc-90 103.02,77.78 103.02,76.2 | IC6.2 107.78,66.03 R32.2 107.81,69.23 | 107.81,69.23 R50.2 | 103.05,72.41 C102.1 103.97,72.39 105.56,73.97 110.33,73.97 | 107.81,69.23 110.3,69.23 110.33,69.21 110.33,73.97 | 103.02,75.88 C101.1 103.02,76.2 | 110.33,73.97 110.33,74.61 arc90 107.78,77.15 106.83,77.15 arc23 105.25,76.83 arc-13 103.02,76.2
IOUTR+
  Top 0.305: 84.61,75.88 84.61,75.56
  Top 0.406: IC4.11 58.62,70.85 59.52,71.75 64.6,71.75 68,71.75 arc45 69.79,72.49 R56.1 75.62,73.02 arc45 77.41,73.76 80.05,76.4 arc-45 81.85,77.15 83.36,77.15 arc-90 C105.2 84.61,75.88 arc53 85.88,76.51 arc-53 87.15,77.15 90.64,77.15 arc-90 93.18,74.61 93.18,73.97 | IC8.2 89.37,66.03 89.37,69.21 | 89.37,69.21 R58.2 | 89.37,69.21 91.59,69.21 91.91,69.53 R59.2 arc-37 92.55,71.43 arc38 93.18,73.34 93.18,73.97 | C107.2 85.56,72.39 87.15,73.97 93.18,73.97
IOUTR-
  Top 0.305: C107.1 82.7,72.39
  Top 0.406: IC8.6 78.89,67.31 78.89,69.21 | 78.89,69.21 R60.2 | 76.67,69.53 R61.2 | 76.67,69.53 76.67,69.21 78.89,69.21 | C106.1 81.78,75.9 arc90 78.89,72.39 R60.2 | C107.1 79.84,72.39 arc90 R60.2 | 76.67,69.53 arc90 74.45,71.75 R57.1 72.65,71.54 arc-45 70.85,70.8 59.84,70.8 59.27,70.23 IC4.12
ISP_MOSI
  Top 0.406: 39.2,78.1 29.68,78.1 29.04,78.1 24.92,73.97 24.92,63.81 25.77,62.95 IC3.15 | 39.2,78.1 R2.1 | 39.2,78.1 44.92,78.1 arc90 46.19,79.37 | 46.19,79.37 arc90 44.92,80.64 19.52,80.64 18.25,81.91 SL3.6 | 46.19,79.37 R16.2
LCD_D4  (via drill 0.6 pad 1.68)
  Top 0.406: R13.R4$2 20.54,37.21 18.25,34.92 v16.98,34.92 TP9.1
LCD_D5  (via drill 0.6 pad 1.68)
  Top 0.406: R13.R3$2 21.34,35.47 18.25,32.38 v16.98,32.38 TP10.1
LCD_D6  (via drill 0.6 pad 1.68)
  Top 0.406: R13.R2$2 22.14,33.73 18.25,29.84 v16.98,29.84 TP11.1
LCD_D7  (via drill 0.6 pad 1.68)
  Top 0.406: TP12.1 v16.98,27.3 18.25,27.3 22.94,31.99 R13.R1$2
LCD_EN  (via drill 0.6 pad 1.68)
  Top 0.406: R14.R1$2 27.39,27.55 22.06,22.22 v16.98,22.22 TP14.1
LCD_GND
  Top 0.406: 11.26,48.89 C49.- | 11.26,45.72 C50.2 | L1.2 11.51,62.61 11.58,62.54 13.38,64.34 C76.2 | 11.26,60.95 11.29,60.98
  Top 0.61: 11.26,40.32 11.26,40 | 11.26,40.32 11.26,45.72 11.26,48.89 11.26,60.95 L1.2 | TP26.1 13.17,37.46 11.26,39.37 11.26,40.32 | 11.29,60.98 R24.1
LCD_LED  (via drill 0.6 pad 1.68)
  Top 0.61: 14.76,55.56 14.75,55.55 Q2.E 14.75,55.24 14.76,55.24 14.76,52.38 15.71,51.43 17.93,51.43 19.2,50.16 19.2,44.45 v16.98,42.54 TP25.1
  pour Top (isolate 0.305): 16.66,54.92 16.66,53.65 14.76,52.38 14.76,57.78 16.66,57.78 16.66,53.97
LCD_PWMIN  (via drill 0.6 pad 1.68)
  Top 0.406: IC3.13 27.38,65.32 v27.14,66.03 | R20.1 16.03,64.45 15.71,64.77 v15.71,66.03
  Bottom 0.813: v15.71,66.03 v27.14,66.03
LCD_RS  (via drill 0.6 pad 1.68)
  Top 0.406: R14.R2$2 26.59,28.65 22.7,24.76 v16.98,24.76 TP13.1
LRCLK
  Top 0.254: 52.54,54.61 52.54,56.51
  Top 0.305: 51.48,58.63 R7.1 51.27,58.73
  Top 0.406: IC1.28 51.91,51.11 52.54,51.75 52.54,54.61 | IC4.2 52.77,58.97 52.54,58.73 | 52.54,58.73 51.27,58.73 | 52.54,56.51 52.54,58.73
MCU_RESET  (via drill 0.6 pad 1.68)
  Top 0.305: 37.3,23.49 36.98,23.17 26.82,23.17 26.5,22.85
  Top 0.406: IC3.29 28.18,47.86 29.68,46.35 31.11,46.35 36.03,41.11 36.03,28.57 37.3,27.3 37.3,26.03 | SW1.1 11.26,13.96 16.98,13.96 23.96,20.95 24.6,20.95 26.5,22.85 | 37.3,23.49 37.3,26.03 | R12.1 43.33,26.03 37.3,26.03
  Top 0.61: SW1.2 SW1.1 8.72,17.14 8.72,68.89 11.9,72.07 11.9,77.78 13.49,79.37 v14.44,79.37 SL3.5
MISO  (via drill 0.6 pad 1.68)
  Top 0.305: 65.88,48.89 IC1.17 MISO.TP | 43.65,49.21 43.65,49.52 43.65,46.35 | 42.7,62.54 42.72,62.57 R4.1 42.72,64.42 42.06,65.08 42.06,68.26 v44.28,70.48
  Top 0.406: 65.88,48.89 60.8,43.97 46.19,43.97 43.65,46.35 | 43.65,49.52 43.65,61.59 42.7,62.54 | 23.96,74.29 SL3.3 | v44.28,79.37 29.04,79.37 23.96,74.29 | R48.1 24.28,63.18 23.96,63.5 23.96,74.29
  Bottom 0.813: v44.28,79.37 v44.28,70.48
MOSI
  Top 0.254: 56.35,48.26 56.35,51.11 56.98,51.75
  Top 0.305: 56.98,51.75 56.98,58.41 57.62,59.05 | 67.3,53.81
  Top 0.406: IC1.15 68.41,52.7 67.3,53.81 65.24,55.88 65.24,59.05 | 57.62,59.05 65.24,59.05 | 56.35,48.26 56.35,47.3 55.4,46.35 50.63,46.35 49.05,47.94 49.05,54.61 48.41,55.24 48.41,61.27 49.05,61.91 49.05,69.53 51.27,71.75 53.17,71.75 54.73,73.3 IC4.24 54.73,77.19 53.49,78.42 52.54,79.37 R16.1 | 65.24,59.05 MOSI.TP
N$1
  Top 0.61: R1.1 63.65,35.55 C28.2
N$3
  Top 0.406: 53.49,9.84 53.17,9.84 T1.11 | 51.91,9.52 51.93,9.54 R26.1 53.49,9.84 | 53.49,9.84 C11.2
N$7
  Top 0.406: R27.1 66.51,9.84 | 66.51,9.84 C12.2 | 66.51,9.84 T2.11
N$8
  Top 0.406: C57.2 56.98,9.52 T1.14
N$9
  Top 0.406: 16.03,62.54 R20.2 | C76.1 15.93,62.65 16.03,62.54 | 16.03,62.54 R23.1
N$10
  Top 0.2: 10.95,38.73 12.54,37.14
N$11  (via drill 0.6 pad 1.68)
  Top 0.406: IC3.7 32.95,55.97 33.81,56.83 35.71,56.83 v35.71,56.51 Q1.2
  Bottom 0.406: Q1.2 35.71,55.56 C22.1
N$12  (via drill 0.6 pad 1.68)
  Top 0.305: 51.59,55.56 R7.2 | 51.59,55.56 R9.2 | R10.2 46.51,66.03 v46.83,66.35 | R8.2 51.59,55.56
  Top 0.406: v51.27,60.32 50.32,60.32 50,60 50,56.51 50.95,55.56 51.59,55.56
  Bottom 0.61: 48.09,69.53 SJ1.1
  Bottom 0.8: v51.27,60.32 50.63,60.32
  Bottom 0.813: 50.63,60.32 46.83,64.13 v46.83,66.35 48.09,67.62 48.09,69.53
N$13
  Top 0.406: 72.22,24.12 72.54,24.44 72.54,57.78 69.69,60.64
N$14
  Top 0.2: 10.95,38.09 11.9,37.14
N$15
  Top 0.406: IC5.3 32.22,35.55 31.9,35.87 30.95,35.87 C51.2
N$16
  Top 0.406: R22.2 13.17,53.02 13.8,53.65 Q2.C
N$17
  Top 0.2: 10.95,37.46 11.26,37.14
N$18
  Top 0.406: R13.R4$1 20.54,50.87 21.65,51.97 IC3.23
N$19
  Top 0.305: IC3.24 23.39,51.17
  Top 0.406: R13.R3$1 21.34,50.4 22.12,51.17 IC3.24
N$20
  Top 0.305: 24.92,49.84 24.98,49.79 IC3.25 24.98,49.58 24.92,49.52
  Top 0.406: R13.R2$1 22.14,49.29 22.38,49.52 24.92,49.52
N$21
  Top 0.406: R13.R1$1 25.37,48.39 25.77,48.8 IC3.26
N$22
  Top 0.305: R14.R2$1 26.59,47.22 26.5,47.3 26.57,47.37
  Top 0.406: 26.57,47.37 IC3.27
N$23
  Top 0.305: 27.42,47.02 27.46,46.98 | R14.R1$1 27.42,47.02 | 27.42,47.02 27.38,47.07
  Top 0.406: 27.38,47.07 IC3.28
N$24
  Top 0.406: 95.08,65.72 C103.2 R31.1
N$25
  Top 0.406: Q2.B 12.86,55.87 12.22,56.51 12.22,58.41 12.85,59.05 13.8,59.05 R24.2 16,59.02 16.03,59.05 | 16.03,59.05 15.93,59.15 | 16.03,59.05 R23.2
N$26
  Top 0.406: C51.1 30.95,38.09 IC5.1
N$27
  Top 0.305: C52.1 30.95,34.6
  Top 0.406: C52.1 30.95,34.28 IC5.4
N$28
  Top 0.406: R15.R2$2 30.23,71.03 30.95,71.75 SL5.3
N$29
  Top 0.406: R15.R1$2 29.43,72.77 30.95,74.29 SL5.4
N$30
  Top 0.406: R15.R3$2 31.03,68.66 31.59,69.21 SL5.2
N$31
  Top 0.305: 30.63,58.41 30.57,58.36 IC3.9
  Top 0.406: R15.R3$1 31.03,60.72 30.63,60.32 30.63,58.41
N$32
  Top 0.406: R15.R2$1 30.23,60.87 29.77,60.41 IC3.10
N$33
  Top 0.406: R15.R1$1 29.4,61 28.97,60.57 IC3.11
N$34
  Top 0.406: C52.2 30.95,33.02 IC5.5
N$35
  Top 0.305: IC5.2 35.08,36.83 35.08,39.37 30.95,39.37
  Top 0.406: 30.95,39.37 C53.2
N$36
  Top 0.406: C54.1 30.95,30.79 31.9,31.74 IC5.6
N$37
  Top 0.305: 60.8,67.94 60.61,68.12 IC4.14
  Top 0.406: 60.8,67.94 R11.2 65.88,67.94
N$38  (via drill 0.6 pad 1.68)
  Bottom 1.27: L6.1 107.78,13.96 110.33,16.51 110.33,22.22 v108.42,22.22 SL1.2
N$39
  Top 0.305: C2.+ 57.62,77.78 57.72,77.89 | C1.1 59.84,77.15 59.92,77.06
  Top 0.406: IC4.16 59.92,77.06 | C2.+ 57.62,77.47 57.84,77.25 C1.1
N$40
  Top 0.406: C63.2 R36.1 arc90 97.62,45.72 IC7.2
N$41
  Top 0.406: C64.1 107.47,45.08 107.47,47.3 R35.1 | IC7.3 99.21,46.98 arc10 103.02,47.3 arc-10 R35.1 | R35.1 107.15,50.48 | 107.15,50.48 107.47,50.8 | 107.15,50.48 106.83,50.8
N$42
  Top 0.406: 97.31,64.13 97.31,66.03 IC6.7 101.75,66.03 102.07,65.72 102.07,63.5 R51.2 101.44,60 | 97.31,64.13 R30.1 | C103.1 95.08,64.13 97.31,64.13 | 101.44,60 101.12,59.69 | 101.44,60 101.75,59.69
N$43
  Top 0.406: IC3.16 24.98,58.36 24.92,58.41 24.92,59.37 24.28,60 R48.2
N$44
  Top 0.406: C67.2 R37.1 arc-90 89.37,46.98 IC7.6
N$45
  Top 0.406: C68.1 80.48,45.08 R42.1 | IC7.5 86.51,48.26 arc17 82.39,47.62 arc-35 R42.1 | R42.1 80.48,50.16 | 80.48,50.16 80.16,50.48 | 80.48,50.16 80.8,50.48
N$46  (via drill 0.6 pad 1.68)
  Bottom 1.27: SL1.4 v108.42,27.3 110.33,27.3 112.86,24.76 112.86,15.23 109.05,11.43 81.75,11.43 72.86,2.54 16.98,2.54 11.9,7.62 L7.1
N$48
  Top 0.406: C63.1 100.8,38.73 100.78,38.7 R34.2
N$49
  Top 0.406: 106.83,52.07 107.15,52.38 107.47,52.07
N$50
  Top 0.406: 90.64,45.72 IC7.7 89.69,45.72 arc90 88.1,44.13 R43.2 R47.1 | R47.1 88.1,40.64 | R47.1 88.42,40.64 arc-15 90.64,38.09 R45.2 89.05,36.19
N$51
  Top 0.406: R53.1 32.86,16.19 29.36,12.7 29.36,11.74 29.48,11.86 X2.2
N$52
  Top 0.406: IC7.1 96.36,44.45 arc-90 R38.2 R34.1 98.26,40.64 arc37 95.08,37.46 R40.2 97.31,36.19
N$53
  Bottom 1.27: SL1.3 103.97,24.76 103.34,24.12 L8.1
N$54
  Bottom 0.61: L9.1 SL1.9
N$55
  Top 0.406: R47.2 85.56,38.7 C67.1
N$56
  Top 0.305: R65.1 51.59,77.78
  Top 0.406: IC4.26 53.42,76.9 52.54,77.78 R65.1
N$57
  Top 0.406: IC4.25 54.08,73.6 53.17,72.7 50.32,72.7 R49.1
N$58
  Top 0.406: X2.3 32.22,13.33 35.39,16.51 35.39,21.27 R52.1
N$60
  Bottom 0.813: L10.1 104.84,43.9 106.2,42.54 SL1.10
N$61
  Top 0.61: 76.67,82.55 L11.2 | 76.67,82.55 arc80 R57.2 | 73.5,82.55 arc62 R56.2 | 73.5,82.55 76.67,82.55 | 73.5,82.55 70.64,82.55 arc25 R28.2 | 73.5,82.55 67.78,82.55 arc-28 R29.2 C14.+
N$62
  Top 0.406: 55.1,23.47 R66.1 55.08,23.49 55.4,23.17 56.98,23.17 T1.3
N$63
  Top 0.406: T1.2 58.26,23.17 59.84,23.17 60.16,23.49 R67.1
N$64  (via drill 0.6 pad 1.68)
  other vias: 14.44,81.91
N$65  (via drill 0.6 pad 1.68)
  other vias: 14.44,74.29
N$66  (via drill 0.6 pad 1.68)
  other vias: 34.76,74.29
N$67  (via drill 0.6 pad 1.68)
  other vias: 34.76,71.75
N$68  (via drill 0.6 pad 1.68)
  other vias: 34.76,69.21
N$69  (via drill 0.6 pad 1.68)
  other vias: 16.98,37.46
N$70  (via drill 0.6 pad 1.68)
  other vias: 16.98,40
N$71  (via drill 0.6 pad 1.68)
  other vias: 108.42,24.76
N$72  (via drill 0.6 pad 1.68)
  other vias: 108.42,29.84
N$73  (via drill 0.6 pad 1.68)
  other vias: 108.42,32.38
N$74  (via drill 0.6 pad 1.68)
  other vias: 108.42,34.92
N$75  (via drill 0.6 pad 1.68)
  other vias: 108.42,37.46
N$76  (via drill 0.6 pad 1.68)
  other vias: 108.42,40
N$77  (via drill 0.6 pad 1.68)
  other vias: 108.42,42.54
N$78  (via drill 0.6 pad 1.68)
  other vias: 88.1,31.11
N$79
  Top 0.305: 107.78,64.13 110.33,64.13
  Top 0.406: 110.33,64.13 C104.1 | R32.1 107.78,64.13 107.78,64.77 IC6.1 105.25,64.77 R54.2 105.25,60 | 105.25,60 104.93,59.69 | 105.56,59.69 105.25,60
N$80
  Top 0.406: C108.1 91.91,64.13 89.37,64.13 | 89.37,64.13 89.37,64.77 IC8.1 86.83,64.77 R62.2 86.83,60 | 89.37,64.13 R58.1 | 86.83,60 87.15,59.69 | 86.83,60 86.51,59.69
N$81
  Top 0.406: C104.2 R50.1
N$82
  Top 0.406: 91.91,65.72 C108.2 R59.1
N$83
  Top 0.406: 78.89,64.13 78.89,66.03 IC8.7 83.34,66.03 83.66,65.72 83.66,63.81 83.02,63.18 R63.2 83.02,60 | 78.89,64.13 R60.1 | C109.1 76.67,64.13 78.89,64.13 | 83.02,60 82.7,59.69 | 83.02,60 83.34,59.69
N$84
  Top 0.406: 76.67,65.72 C109.2 R61.1
N$85  (via drill 0.6 pad 1.68)
  other vias: 90.64,31.11
N$86  (via drill 0.6 pad 1.68)
  other vias: 95.72,31.11
N$87  (via drill 0.6 pad 1.68)
  other vias: 98.26,31.11
N$88  (via drill 0.6 pad 1.68)
  Top 0.406: IC3.8 32.48,56.77 35.71,60 35.71,60.32
  Top 0.61: Q1.1 35.71,60.32 v35.71,59.69
  Bottom 0.406: Q1.1 35.71,60.64 35.08,61.27 C23.1
N$89
  Top 0.406: 84.61,36.19 87.15,36.19
N$90
  Top 0.406: 76.99,52.07 77.3,52.38 77.62,52.07
OMCK
  Top 0.305: IC1.25 55.71,51.75 56.35,52.38 56.35,59.37 56.98,60
  Top 0.406: OMCK.1 57.62,60.64 56.98,60
PAGND  (via drill 0.6 pad 1.68)
  Top 0.254: 59.84,37.78 60.16,37.46
  Top 0.305: 64.92,30.79 | C13.2 62.38,30.79
  Top 0.406: 47.78,33.97 D1.1 | 64.92,30.79 D2.1 62.38,30.79 | C21.2 57.09,27.83 56.98,27.94 56.99,27.94 D4.1 55.88,28.1 v55.71,27.94 | C20.2 52.22,28.25 52.23,28.26 D3.1 | 64.92,30.79 64.92,23.81 65.24,23.49 T2.7
  Top 0.61: D2.1 61.28,33.8 61.11,33.97 | 51.91,19.36 T1.7 | 51.91,19.36 47.78,19.36 47.78,29.52 R18.2 47.75,32.67 47.78,32.7 | 47.88,33.87 47.78,33.97 47.78,32.7 | 47.78,32.7 C59.2 | v55.71,17.46 53.81,17.46 51.91,19.36
  other vias: 61.43,33.02 51.91,36.19
  pour Top (isolate 0.406, no thermals): 58.57,34.92 60.48,34.92 60.48,38.09 59.84,38.41 59.52,41.27 59.21,38.41 58.57,38.09
  pour Bottom (isolate 0.61): 70.32,45.08 50,45.08 51.27,16.19 70.32,16.19
  pour Top (isolate 0.61, rank 2, no thermals): 50,45.08 50,29.84 70.32,29.84 70.32,45.08
PAVDD_33  (via drill 0.6 pad 1.68)
  Top 0.305: C59.1 49.58,34.18 | 62.38,28.89 C13.1 | 56.03,35.87
  Top 0.406: IC1.6 58.26,39.37 56.67,37.78 | 49.68,34.28 | 49.68,34.28 D1.2 | 49.58,34.18 49.68,34.28 | 63.65,28.89 63.66,28.89 D2.2 | 56.03,35.87 56.03,37.14 56.67,37.78 | C21.1 58.89,26.66 58.89,26.67 D4.2 | C20.1 54.13,28.25 54.12,28.26 D3.2 | 56.67,37.78 C9.2
  Top 0.604: C10.+ 56.35,35.24 56.03,34.92 v58.57,32.38 | D3.2 54.12,29.21 54.13,29.2 54.76,29.84 v55.71,29.84 | D4.2 58.89,28.25 60.8,30.16
  Top 0.61: v58.57,32.38 60.8,30.16 62.06,28.89 62.38,28.89 63.65,28.89 | C10.+ 56.03,35.24 56.03,35.87 | C59.1 49.58,27.09 v51.91,24.76
  Bottom 1.27: 58.57,14.92 52.22,14.92 51.91,15.23 v51.91,24.76 | 58.57,14.92 67.78,14.92 arc90 70.32,16.82 70.32,21.59 arc-90 72.86,24.12 L8.2 | 58.57,14.92 58.57,29.84 | 58.57,29.84 v58.57,32.38 | 58.57,29.84 v55.71,29.84
PLL_LF1
  Top 0.406: IC1.8 60.8,39.37 62.06,38.09 62.06,37.46
  Top 0.61: C19.2 62.06,37.46 62.09,37.48 R1.2
RCA1-G
  Top 0.406: RCA1G.1 50,7.93 50,9.84 R26.2 49.98,11.08 50.63,11.74 T1.9 50.63,12.06 50.61,11.72
RCA1-I
  Top 0.406: RCA1.1 55.4,8.25 55.4,9.52 C11.1
RCA2-G
  Top 0.406: RCA2G.1 63.97,8.88 63.97,9.84 R27.2 63.95,10.13 63.97,10.16 T2.9
RCA2-I
  Top 0.406: C12.1 69.05,9.84 RCA2.1
RECVINT
  Top 0.305: 44.92,49.52 R33.1
  Top 0.406: 44.92,49.52 44.92,46.35 46.83,44.76 60,44.76 62.06,46.83 IC1.20
RMCK
  Top 0.305: 45.55,62.86 45.24,62.86 | 46.51,62.86 R10.1 | IC1.24
  Top 0.406: IC4.27 52.77,73.89 52.54,73.66 49.05,73.66 46.83,71.43 46.83,68.58 45.24,66.99 45.24,62.86 | 46.51,62.86 45.55,62.86 45.55,54.29 48.09,51.75 48.09,47.62 50.16,45.56 56.03,45.56 56.98,46.51 IC1.24
RXN
  Top 0.205: 57.94,25.71 57.94,27.62
  Top 0.406: IC1.5 56.98,39.37 54.45,36.83 54.45,33.65 57.94,30.16 | R67.2 59.23,25.42 58.57,24.76 R17.2 58.6,25.05 57.94,25.71 | 57.94,30.16 D4.3 | 57.94,27.62 57.94,30.16
RXP0
  Top 0.205: 53.17,27.3 53.17,28.89
  Top 0.406: IC1.4 55.71,39.37 53.17,36.83 D3.3 53.17,30.79 53.17,28.89 | R17.1 56.67,24.76 56.01,25.42 R66.2 54.79,25.42 54.76,25.4 53.17,26.98 53.17,27.3
RXP1
  Top 0.254: 48.73,31.43 48.73,33.65
  Top 0.406: D1.3 48.9,36.34 | IC1.3 54.45,42.22 50.95,42.22 49.68,40.95 49.68,37.46 48.73,36.51 D1.3 | R18.1 49.68,24.12 | R18.1 49.71,25.37 48.73,26.35 48.73,31.43 | 48.73,33.65 D1.3 | T1.6 53.17,22.85 52.86,23.17 50.95,23.17 50,24.12 R18.1
RXP2
  Top 0.205: 53.81,20 53.81,22.85
  Top 0.305: 53.17,39.37 IC1.2 | 66.02,32.21 66.51,32.7
  Top 0.406: 66.51,32.7 R25.1 | 53.17,39.37 50.63,36.83 50.63,35.24 50.95,34.92 50.95,31.74 50.63,31.43 50.63,27.94 53.81,24.76 53.81,22.85 | 53.81,20 54.45,19.36 66.51,19.36 T2.6 66.51,23.81 66.02,24.3 D2.3 66.02,32.21
SDATA
  Top 0.305: IC4.4 54.08,67.04 54.76,66.35 | IC1.26 54.45,53.02 54.76,53.34 | 51.27,52.07 R9.1
  Top 0.406: 54.76,53.34 54.76,66.35 | 51.27,52.07 50.95,51.75 50.95,48.26 51.27,47.94 53.97,47.94 54.45,48.41 IC1.26
SNDRST  (via drill 0.6 pad 1.68)
  Top 0.254: 55.08,48.1 55.08,51.43
  Top 0.305: IC1.9 62.06,40.32 | 55.08,51.43 55.08,52.38 55.71,53.02 55.71,60.64 56.35,61.27 | 50,48.1 50.95,47.14 54.29,47.14 55.08,47.94 55.08,48.1
  Top 0.406: IC1.9 62.06,42.22 64.29,42.22 69.69,47.94 69.69,53.02 66.19,56.51 66.19,59.37 66.51,59.69 66.51,60.95 65.24,62.23 57.3,62.23 56.35,61.27 | 50,48.1 50,54.92 49.37,55.56 49.37,60.64 50,61.27 50,69.21 51.91,71.11 53.49,71.11 55.38,73 IC4.23 55.38,78.44 51.91,81.91 v29.68,81.91 | IC3.14 26.57,63.74 25.87,64.45 25.87,69.21 v26.5,69.84 | v21.42,69.84 R19.1
  Bottom 0.813: v29.68,81.91 26.5,78.73 v26.5,69.84 v21.42,69.84
SPDIF_INT
  Top 0.406: R33.2 37.62,49.52 35.97,51.17 IC3.1
SPI_CLK  (via drill 0.6 pad 1.68)
  Top 0.305: IC1.16 SCK.TP | R3.1 41.11,57.15 | 42.7,47.94 arc90 43.02,48.26 43.02,50.48 arc90 42.7,50.8 arc-90 42.38,51.11 | IC3.17 30.57,56.77 31.59,57.78
  Top 0.406: 31.59,57.78 31.59,60 35.71,64.13 41.11,64.13 | SL3.4 v14.44,76.83 13.49,76.83 13.17,76.51 13.17,73.34 13.49,73.02 21.11,73.02 23.01,71.11 23.01,56.83 23.42,56.83 IC3.17 | IC1.16 67.14,47.94 62.38,43.18 45.55,43.18 42.38,46.35 42.38,47.62 arc-90 42.7,47.94 | 41.11,64.13 41.74,64.13 41.74,61.59 42.38,61.59 42.7,61.27 42.7,59.05 42.38,58.73 42.38,57.15 | 42.38,57.15 R3.1 | 42.38,57.15 42.38,51.11 | 41.11,64.13 41.11,69.84 49.05,77.78 R65.2
SS_DAC  (via drill 0.6 pad 1.68)
  Top 0.305: R6.1 40.16,59.37
  Top 0.406: v41.43,60 41.11,59.37 R6.1 40.18,53.36 38.79,51.97 IC3.2 | v46.83,60 46.83,61.59 48.09,62.86 48.09,70.48 R49.2
  Bottom 0.813: v41.43,60 v46.83,60
SS_RECV  (via drill 0.6 pad 1.68)
  Top 0.305: R5.1 36.98,65.08
  Top 0.406: IC1.14 68.41,44.45 70.95,46.98 70.95,54.61 v67.78,57.78 | R5.1 v36.98,76.2 29.36,76.2 28.09,74.92 28.09,66.99 arc-90 28.41,65.4 arc-19 28.18,65.16 IC3.12
  Bottom 0.813: v67.78,57.78 65.88,55.88 40.79,55.88 38.89,57.78 38.89,62.86 36.98,64.77 v36.98,76.2
USART_RXD
  Top 0.406: IC3.30 28.97,48.33 30,47.3 31.74,47.3 36.98,41.75 36.98,40.64 | 36.98,40.64 36.98,29.52 37.3,29.2 IC5.9 | 36.98,40.64 TP20.TP
USART_TXD
  Top 0.305: 30.31,48.26 30,48.57
  Top 0.406: IC3.31 29.77,48.8 30.31,48.26 35.71,48.26 45.24,38.73 45.24,36.83 | 45.24,36.83 45.24,26.98 41.74,26.98 41.74,30.48 41.11,30.48 | 45.24,36.83 45.24,37.14 | IC5.10 41.11,30.48 | 41.11,30.48 TP19.TP
VBIASX
  Top 0.305: 99.53,70.48 99.56,70.51 R55.1
  Top 0.406: IC6.3 103.34,67.31 102.07,68.58 100.17,68.58 | IC6.5 100.17,68.58 | 100.17,68.58 100.06,68.68 100.06,70.27 99.72,70.61 R55.1
VBIASY
  Top 0.406: 82.07,68.58 83.66,68.58 84.92,67.31 IC8.3 | IC8.5 82.07,68.58 | 82.07,68.58 81.96,68.68 81.96,68.9 arc45 81.22,70.7 81.15,70.76 | 81.15,70.76 81.11,70.8 | 81.15,70.76 R64.1
VOUT_LEFT
  Top 0.406: 102.7,33.97 102.6,33.87 100.9,33.87 100.8,33.97 R41.1 98.58,34.92 arc127 95.72,32.7 SL4.2 | 102.7,33.97 C65.1 | 102.7,33.97 arc90 102.7,35.55 R40.1 99.21,36.19
VOUT_RIGHT
  Top 0.406: 85.56,33.97 85.46,33.87 C69.1 83.66,33.97 arc-90 83.66,35.55 R45.1 | 85.56,33.97 R46.1 | 85.56,33.97 86.83,34.92 arc-141 SL2.1
VOUTL+
  Top 0.305: C61.2 OUTL+.PP
  Top 0.406: R38.1 R36.2 100.8,50.8 100.48,51.11 100.48,52.07 C61.2 100.48,52.7 100.48,54.29 R51.1 101.44,58.1 | 101.44,58.1 101.75,58.41 | 101.44,58.1 101.12,58.41
VOUTL-
  Top 0.406: R54.1 R35.2 | R39.2 110.01,55.24 | R35.2 R39.2 | 105.25,53.02 105.14,52.91 C62.1 104.93,52.7 | OUTL-.PP arc90 104.93,51.75 104.93,52.7 | R54.1 104.93,54.92 104.93,52.7 | R54.1 105.25,58.1 | 105.25,58.1 105.56,58.41 | 105.25,58.1 104.93,58.41 | R35.2 107.15,52.38 | R39.2 110.33,52.38 | 110.33,52.38 110.01,52.07 | 110.33,52.38 110.64,52.07
VOUTR+
  Top 0.305: 87.47,52.7 OUTR+.PP
  Top 0.406: 87.47,52.7 C60.2 | 87.47,52.7 87.47,53.65 86.83,54.29 R62.1 86.83,58.1 | R37.2 87.47,50.16 | 87.47,50.16 R43.1 | 87.47,50.16 87.47,52.7 | 86.83,58.1 87.15,58.41 | 86.83,58.1 86.51,58.41
VOUTR-
  Top 0.406: R42.2 R63.1 | R42.2 R44.2 77.3,52.38 | R63.1 83.02,54.29 82.39,53.65 82.39,52.7 C66.1 82.49,50.69 arc90 OUTR-.PP | R42.2 80.48,52.38 | 80.48,52.38 80.16,52.07 | R63.1 83.02,58.1 | 83.02,58.1 83.34,58.41 | 83.02,58.1 82.7,58.41 | 80.48,52.38 80.8,52.07
VREF  (via drill 0.6 pad 1.68)
  Top 0.305: C3.1 59.84,66.03 59.92,66.12 IC4.13 | 97.62,78.1 97.59,78.07 R55.2 97.59,77.82 | 79.18,78.07 arc-90 79.21,78.1 79.18,78.07 | 97.59,77.82 97.62,77.78 | 97.31,78.1 97.59,77.82 | 79.18,78.07 R64.2
  Top 0.406: IC4.13 59.92,69.61 60.16,69.84 72.6,69.84 arc-45 74.13,69.21 v74.77,69.21 | 97.31,78.1 79.21,78.1 76.78,75.67 arc-45 74.98,74.92 v74.77,74.92 | C4.+ 64.86,66.41 64.6,66.67 60.16,66.67 59.84,66.35 C3.1
  Bottom 0.61: 75.29,74.4 v74.77,74.92
  Bottom 0.813: v74.77,69.21 75.29,69.74 arc45 76.03,71.53 76.03,72.6 arc45 75.29,74.4
XLR+
  Top 0.406: C57.1 58.89,9.52 XLR+.1
XLR-
  Top 0.406: T1.16 59.52,12.06 61.43,10.16 XLR-.1
(copper drawn outside any net)
  shapes: Top circle x2

## Text on the board
Top: 12M | 12P | D4 | A50 | D50 | L C D | RIGHT | LEFT | D7 | L50 | RS | A33 | EN | D33 | SPDIF& | AES/EBU | D/A CONVERTER | SVO | REV.B Q106 | 2006 | L1+ | +XLR- | L2+
tRestrict: ericon soft | rezonit